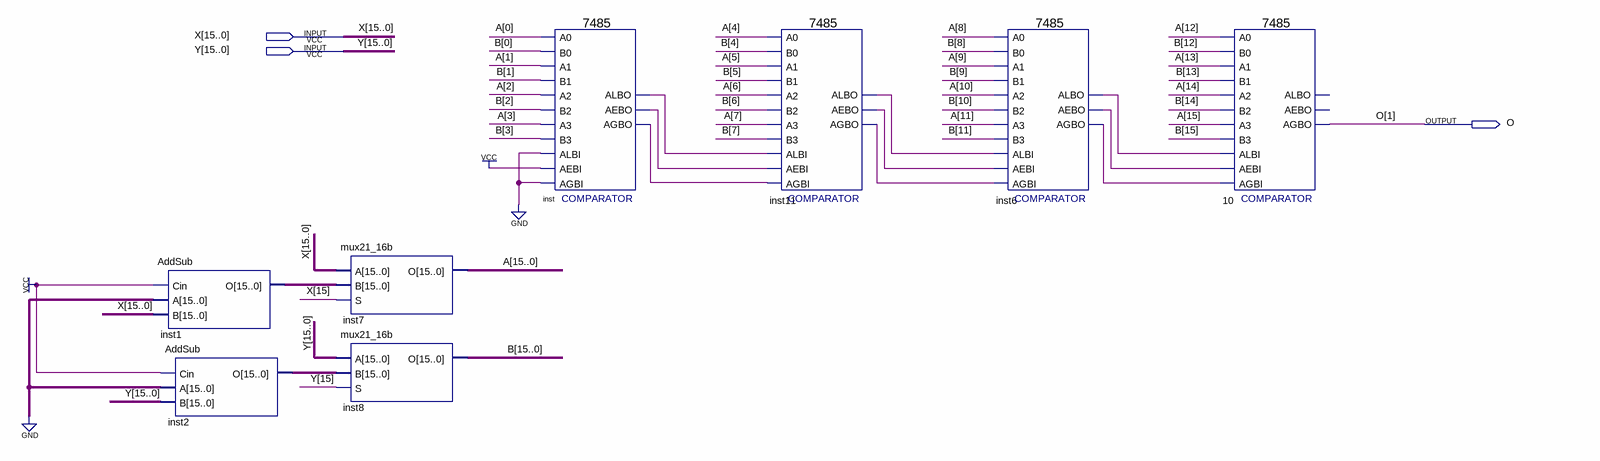
[diagram p0: schematic sheet]
// Quartus schematic Comparator.bdf as structural Verilog: 8 symbols, 3 pins
module Comparator (
  input  [15:0] X,
  input  [15:0] Y,
  output O
);

  wire inst6_aebo, inst6_agbo, inst6_albo, inst11_aebo, inst11_agbo, inst11_albo, inst_aebo, inst_agbo,
       inst_albo;
  wire [15:0] A, B, inst1_o, inst2_o;

  AddSub inst1 (.Cin(1'b1), .A({16{1'b0}}), .B(X), .O(inst1_o));
  AddSub inst2 (.Cin(1'b1), .A({16{1'b0}}), .B(Y), .O(inst2_o));
  mux21_16b inst7 (.A(X), .B(inst1_o), .S(X[15]), .O(A));
  mux21_16b inst8 (.A(Y), .B(inst2_o), .S(Y[15]), .O(B));
  \7485  inst (
    .A3(A[3]), .B2(B[2]), .A2(A[2]), .AEBI(1'b1), .AGBI(1'b0), .ALBI(1'b0), .A0(A[0]), .B0(B[0]), .B3(B[3]),
    .A1(A[1]), .B1(B[1]), .ALBO(inst_albo), .AGBO(inst_agbo), .AEBO(inst_aebo));
  \7485  inst11 (
    .A3(A[7]), .B2(B[6]), .A2(A[6]), .AEBI(inst_aebo), .AGBI(inst_agbo), .ALBI(inst_albo), .A0(A[4]),
    .B0(B[4]), .B3(B[7]), .A1(A[5]), .B1(B[5]), .ALBO(inst11_albo), .AGBO(inst11_agbo), .AEBO(inst11_aebo));
  \7485  inst6 (
    .A3(A[11]), .B2(B[10]), .A2(A[10]), .AEBI(inst11_aebo), .AGBI(inst11_agbo), .ALBI(inst11_albo),
    .A0(A[8]), .B0(B[8]), .B3(B[11]), .A1(A[9]), .B1(B[9]), .ALBO(inst6_albo), .AGBO(inst6_agbo),
    .AEBO(inst6_aebo));
  \7485  u_10 (
    .A3(A[15]), .B2(B[14]), .A2(A[14]), .AEBI(inst6_aebo), .AGBI(inst6_agbo), .ALBI(inst6_albo), .A0(A[12]),
    .B0(B[12]), .B3(B[15]), .A1(A[13]), .B1(B[13]), .AGBO(O));  // open: ALBO, AEBO

  // Other names for the same wires on the sheet: O[1] = O
endmodule
